# Altium project STM32F407ZGT6_Car.PrjPCB
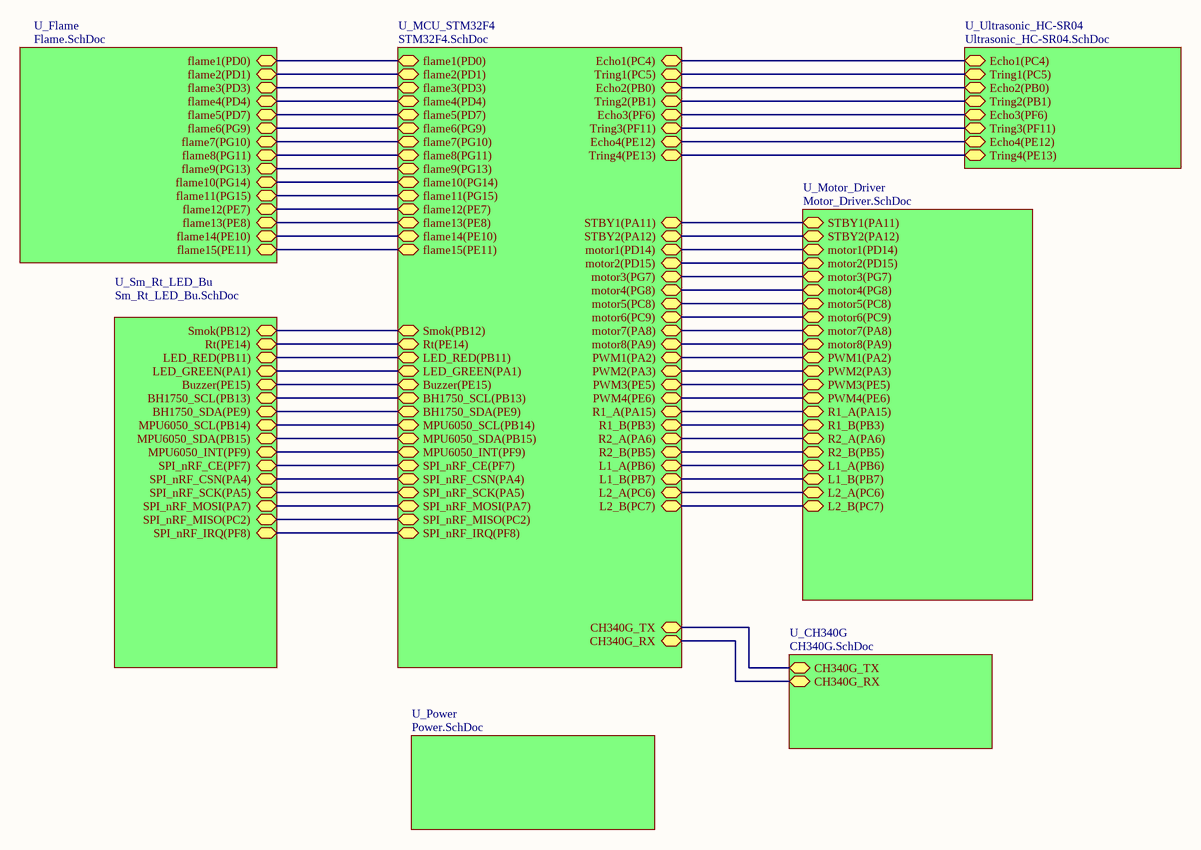
[diagram p0: Frame_Work.SchDoc]
8 sheets, 151 parts. Net scope: hierarchical (ports join the sheet entries above them; power ports are global).
Board file: STM32F4.PcbDoc
Sheets:
  Frame_Work.SchDoc
    U_Flame = Flame.SchDoc
    U_MCU_STM32F4 = STM32F4.SchDoc
    U_Sm_Rt_LED_Bu = Sm_Rt_LED_Bu.SchDoc
    U_Ultrasonic_HC-SR04 = Ultrasonic_HC-SR04.SchDoc
    U_Motor_Driver = Motor_Driver.SchDoc
    U_Power = Power.SchDoc
    U_CH340G = CH340G.SchDoc

## Sheet Frame_Work.SchDoc
size A3

### Sub-sheets
U_CH340G = CH340G.SchDoc: CH340G_TX (bidir), CH340G_RX (bidir)
U_Flame = Flame.SchDoc: flame1(PD0) (bidir), flame2(PD1) (bidir), flame3(PD3) (bidir), flame4(PD4) (bidir), flame5(PD7) (bidir), flame6(PG9) (bidir), flame7(PG10) (bidir), flame8(PG11) (bidir), flame9(PG13) (bidir), flame10(PG14) (bidir), flame11(PG15) (bidir), flame12(PE7) (bidir), flame13(PE8) (bidir), flame14(PE10) (bidir), flame15(PE11) (bidir)
U_MCU_STM32F4 = STM32F4.SchDoc: flame1(PD0) (bidir), flame2(PD1) (bidir), flame3(PD3) (bidir), flame4(PD4) (bidir), flame5(PD7) (bidir), flame6(PG9) (bidir), flame7(PG10) (bidir), flame8(PG11) (bidir), flame9(PG13) (bidir), flame10(PG14) (bidir), flame11(PG15) (bidir), flame12(PE7) (bidir), flame13(PE8) (bidir), flame14(PE10) (bidir), flame15(PE11) (bidir), Smok(PB12) (bidir), Rt(PE14) (bidir), LED_RED(PB11) (bidir), LED_GREEN(PA1) (bidir), Buzzer(PE15) (bidir), Echo1(PC4) (bidir), Tring1(PC5) (bidir), Echo2(PB0) (bidir), Tring2(PB1) (bidir), Echo3(PF6) (bidir), Tring3(PF11) (bidir), Echo4(PE12) (bidir), Tring4(PE13) (bidir), STBY1(PA11) (bidir), STBY2(PA12) (bidir), motor1(PD14) (bidir), motor2(PD15) (bidir), motor3(PG7) (bidir), motor4(PG8) (bidir), motor5(PC8) (bidir), motor6(PC9) (bidir), motor7(PA8) (bidir), motor8(PA9) (bidir), PWM1(PA2) (bidir), PWM2(PA3) (bidir), PWM3(PE5) (bidir), PWM4(PE6) (bidir), R1_A(PA15) (bidir), R1_B(PB3) (bidir), R2_A(PA6) (bidir), R2_B(PB5) (bidir), L1_A(PB6) (bidir), L1_B(PB7) (bidir), L2_A(PC6) (bidir), L2_B(PC7) (bidir), BH1750_SCL(PB13) (bidir), BH1750_SDA(PE9) (bidir), MPU6050_SCL(PB14) (bidir), MPU6050_SDA(PB15) (bidir), MPU6050_INT(PF9) (bidir), SPI_nRF_CE(PF7) (bidir), SPI_nRF_CSN(PA4) (bidir), SPI_nRF_SCK(PA5) (bidir), SPI_nRF_MOSI(PA7) (bidir), SPI_nRF_MISO(PC2) (bidir), SPI_nRF_IRQ(PF8) (bidir), CH340G_TX (bidir), CH340G_RX (bidir)
U_Motor_Driver = Motor_Driver.SchDoc: motor2(PD15) (bidir), motor1(PD14) (bidir), STBY2(PA12) (bidir), STBY1(PA11) (bidir), motor3(PG7) (bidir), motor4(PG8) (bidir), motor5(PC8) (bidir), motor6(PC9) (bidir), motor7(PA8) (bidir), motor8(PA9) (bidir), PWM1(PA2) (bidir), PWM2(PA3) (bidir), PWM3(PE5) (bidir), PWM4(PE6) (bidir), R1_A(PA15) (bidir), R1_B(PB3) (bidir), R2_A(PA6) (bidir), R2_B(PB5) (bidir), L1_A(PB6) (bidir), L1_B(PB7) (bidir), L2_A(PC6) (bidir), L2_B(PC7) (bidir)
U_Power = Power.SchDoc: no entries
U_Sm_Rt_LED_Bu = Sm_Rt_LED_Bu.SchDoc: Smok(PB12) (bidir), Rt(PE14) (bidir), LED_RED(PB11) (bidir), LED_GREEN(PA1) (bidir), Buzzer(PE15) (bidir), BH1750_SCL(PB13) (bidir), BH1750_SDA(PE9) (bidir), MPU6050_SCL(PB14) (bidir), MPU6050_SDA(PB15) (bidir), MPU6050_INT(PF9) (bidir), SPI_nRF_CE(PF7) (bidir), SPI_nRF_CSN(PA4) (bidir), SPI_nRF_SCK(PA5) (bidir), SPI_nRF_MOSI(PA7) (bidir), SPI_nRF_MISO(PC2) (bidir), SPI_nRF_IRQ(PF8) (bidir)
U_Ultrasonic_HC-SR04 = Ultrasonic_HC-SR04.SchDoc: Tring2(PB1) (bidir), Echo2(PB0) (bidir), Tring1(PC5) (bidir), Echo1(PC4) (bidir), Echo3(PF6) (bidir), Tring3(PF11) (bidir), Echo4(PE12) (bidir), Tring4(PE13) (bidir)

### Nets
NetJ1_3: sheet U_Flame/flame5(PD7), sheet U_MCU_STM32F4/flame5(PD7)
NetJ1_4: sheet U_Flame/flame4(PD4), sheet U_MCU_STM32F4/flame4(PD4)
NetJ1_5: sheet U_Flame/flame3(PD3), sheet U_MCU_STM32F4/flame3(PD3)
NetJ1_6: sheet U_Flame/flame2(PD1), sheet U_MCU_STM32F4/flame2(PD1)
NetJ1_7: sheet U_Flame/flame1(PD0), sheet U_MCU_STM32F4/flame1(PD0)
NetJ2_3: sheet U_Flame/flame10(PG14), sheet U_MCU_STM32F4/flame10(PG14)
NetJ2_4: sheet U_Flame/flame9(PG13), sheet U_MCU_STM32F4/flame9(PG13)
NetJ2_5: sheet U_Flame/flame8(PG11), sheet U_MCU_STM32F4/flame8(PG11)
NetJ2_6: sheet U_Flame/flame7(PG10), sheet U_MCU_STM32F4/flame7(PG10)
NetJ2_7: sheet U_Flame/flame6(PG9), sheet U_MCU_STM32F4/flame6(PG9)
NetJ3_3: sheet U_Flame/flame15(PE11), sheet U_MCU_STM32F4/flame15(PE11)
NetJ3_4: sheet U_Flame/flame14(PE10), sheet U_MCU_STM32F4/flame14(PE10)
NetJ3_5: sheet U_Flame/flame13(PE8), sheet U_MCU_STM32F4/flame13(PE8)
NetJ3_6: sheet U_Flame/flame12(PE7), sheet U_MCU_STM32F4/flame12(PE7)
NetJ3_7: sheet U_Flame/flame11(PG15), sheet U_MCU_STM32F4/flame11(PG15)
NetJ4_3: sheet U_MCU_STM32F4/R1_B(PB3), sheet U_Motor_Driver/R1_B(PB3)
NetJ4_4: sheet U_MCU_STM32F4/R1_A(PA15), sheet U_Motor_Driver/R1_A(PA15)
NetJ5_3: sheet U_MCU_STM32F4/R2_B(PB5), sheet U_Motor_Driver/R2_B(PB5)
NetJ5_4: sheet U_MCU_STM32F4/R2_A(PA6), sheet U_Motor_Driver/R2_A(PA6)
NetJ6_3: sheet U_MCU_STM32F4/L2_B(PC7), sheet U_Motor_Driver/L2_B(PC7)
NetJ6_4: sheet U_MCU_STM32F4/L2_A(PC6), sheet U_Motor_Driver/L2_A(PC6)
NetJ7_3: sheet U_MCU_STM32F4/L1_B(PB7), sheet U_Motor_Driver/L1_B(PB7)
NetJ7_4: sheet U_MCU_STM32F4/L1_A(PB6), sheet U_Motor_Driver/L1_A(PB6)
NetJ9_2: sheet U_MCU_STM32F4/Buzzer(PE15), sheet U_Sm_Rt_LED_Bu/Buzzer(PE15)
NetJ10_2: sheet U_MCU_STM32F4/Rt(PE14), sheet U_Sm_Rt_LED_Bu/Rt(PE14)
NetJ11_1: sheet U_MCU_STM32F4/Smok(PB12), sheet U_Sm_Rt_LED_Bu/Smok(PB12)
NetJ12_3: sheet U_MCU_STM32F4/BH1750_SDA(PE9), sheet U_Sm_Rt_LED_Bu/BH1750_SDA(PE9)
NetJ12_4: sheet U_MCU_STM32F4/BH1750_SCL(PB13), sheet U_Sm_Rt_LED_Bu/BH1750_SCL(PB13)
NetJ13_2: sheet U_MCU_STM32F4/Echo1(PC4), sheet U_Ultrasonic_HC-SR04/Echo1(PC4)
NetJ13_3: sheet U_MCU_STM32F4/Tring1(PC5), sheet U_Ultrasonic_HC-SR04/Tring1(PC5)
NetJ14_2: sheet U_MCU_STM32F4/Echo2(PB0), sheet U_Ultrasonic_HC-SR04/Echo2(PB0)
NetJ14_3: sheet U_MCU_STM32F4/Tring2(PB1), sheet U_Ultrasonic_HC-SR04/Tring2(PB1)
NetJ15_2: sheet U_MCU_STM32F4/Echo3(PF6), sheet U_Ultrasonic_HC-SR04/Echo3(PF6)
NetJ15_3: sheet U_MCU_STM32F4/Tring3(PF11), sheet U_Ultrasonic_HC-SR04/Tring3(PF11)
NetJ16_2: sheet U_MCU_STM32F4/Echo4(PE12), sheet U_Ultrasonic_HC-SR04/Echo4(PE12)
NetJ16_3: sheet U_MCU_STM32F4/Tring4(PE13), sheet U_Ultrasonic_HC-SR04/Tring4(PE13)
NetR24_1: sheet U_MCU_STM32F4/LED_RED(PB11), sheet U_Sm_Rt_LED_Bu/LED_RED(PB11)
NetR25_1: sheet U_MCU_STM32F4/LED_GREEN(PA1), sheet U_Sm_Rt_LED_Bu/LED_GREEN(PA1)
NetR31_1: sheet U_MCU_STM32F4/MPU6050_SDA(PB15), sheet U_Sm_Rt_LED_Bu/MPU6050_SDA(PB15)
NetR32_1: sheet U_MCU_STM32F4/MPU6050_SCL(PB14), sheet U_Sm_Rt_LED_Bu/MPU6050_SCL(PB14)
NetU1_15: sheet U_MCU_STM32F4/PWM4(PE6), sheet U_Motor_Driver/PWM4(PE6)
NetU1_16: sheet U_MCU_STM32F4/motor8(PA9), sheet U_Motor_Driver/motor8(PA9)
NetU1_17: sheet U_MCU_STM32F4/motor7(PA8), sheet U_Motor_Driver/motor7(PA8)
NetU1_19: sheet U_MCU_STM32F4/STBY2(PA12), sheet U_Motor_Driver/STBY2(PA12)
NetU1_21: sheet U_MCU_STM32F4/motor6(PC9), sheet U_Motor_Driver/motor6(PC9)
NetU1_22: sheet U_MCU_STM32F4/motor5(PC8), sheet U_Motor_Driver/motor5(PC8)
NetU1_23: sheet U_MCU_STM32F4/PWM3(PE5), sheet U_Motor_Driver/PWM3(PE5)
NetU2_15: sheet U_MCU_STM32F4/PWM2(PA3), sheet U_Motor_Driver/PWM2(PA3)
NetU2_16: sheet U_MCU_STM32F4/motor4(PG8), sheet U_Motor_Driver/motor4(PG8)
NetU2_17: sheet U_MCU_STM32F4/motor3(PG7), sheet U_Motor_Driver/motor3(PG7)
NetU2_19: sheet U_MCU_STM32F4/STBY1(PA11), sheet U_Motor_Driver/STBY1(PA11)
NetU2_21: sheet U_MCU_STM32F4/motor2(PD15), sheet U_Motor_Driver/motor2(PD15)
NetU2_22: sheet U_MCU_STM32F4/motor1(PD14), sheet U_Motor_Driver/motor1(PD14)
NetU2_23: sheet U_MCU_STM32F4/PWM1(PA2), sheet U_Motor_Driver/PWM1(PA2)
NetU8_19: sheet U_MCU_STM32F4/SPI_nRF_CE(PF7), sheet U_Sm_Rt_LED_Bu/SPI_nRF_CE(PF7)
NetU8_20: sheet U_MCU_STM32F4/SPI_nRF_IRQ(PF8), sheet U_Sm_Rt_LED_Bu/SPI_nRF_IRQ(PF8)
NetU8_21: sheet U_MCU_STM32F4/MPU6050_INT(PF9), sheet U_Sm_Rt_LED_Bu/MPU6050_INT(PF9)
NetU8_28: sheet U_MCU_STM32F4/SPI_nRF_MISO(PC2), sheet U_Sm_Rt_LED_Bu/SPI_nRF_MISO(PC2)
NetU8_40: sheet U_MCU_STM32F4/SPI_nRF_CSN(PA4), sheet U_Sm_Rt_LED_Bu/SPI_nRF_CSN(PA4)
NetU8_41: sheet U_MCU_STM32F4/SPI_nRF_SCK(PA5), sheet U_Sm_Rt_LED_Bu/SPI_nRF_SCK(PA5)
NetU8_43: sheet U_MCU_STM32F4/SPI_nRF_MOSI(PA7), sheet U_Sm_Rt_LED_Bu/SPI_nRF_MOSI(PA7)
NetU8_90: sheet U_MCU_STM32F4/CH340G_TX, sheet U_CH340G/CH340G_TX
NetU8_91: sheet U_MCU_STM32F4/CH340G_RX, sheet U_CH340G/CH340G_RX

## Sheet Flame.SchDoc
size A4
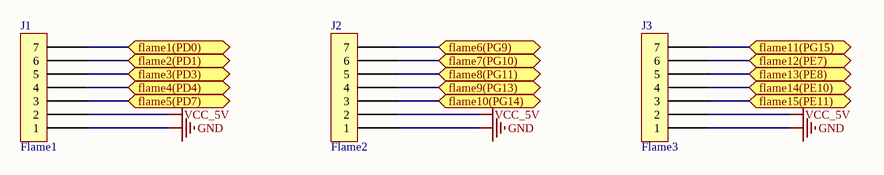
[diagram p1: Flame.SchDoc]

### Parts
J1  Flame1  [XH2.54-LI-7P]
J2  Flame2  [XH2.54-LI-7P]
J3  Flame3  [XH2.54-LI-7P]

### Ports
flame1(PD0) (bidir), flame2(PD1) (bidir), flame3(PD3) (bidir), flame4(PD4) (bidir), flame5(PD7) (bidir), flame6(PG9) (bidir), flame7(PG10) (bidir), flame8(PG11) (bidir), flame9(PG13) (bidir), flame10(PG14) (bidir), flame11(PG15) (bidir), flame12(PE7) (bidir), flame13(PE8) (bidir), flame14(PE10) (bidir), flame15(PE11) (bidir)

### Nets
GND: J1.1 J2.1 J3.1
VCC_5V: J1.2 J2.2 J3.2
NetJ1_3: J1.3 ; port flame5(PD7)
NetJ1_4: J1.4 ; port flame4(PD4)
NetJ1_5: J1.5 ; port flame3(PD3)
NetJ1_6: J1.6 ; port flame2(PD1)
NetJ1_7: J1.7 ; port flame1(PD0)
NetJ2_3: J2.3 ; port flame10(PG14)
NetJ2_4: J2.4 ; port flame9(PG13)
NetJ2_5: J2.5 ; port flame8(PG11)
NetJ2_6: J2.6 ; port flame7(PG10)
NetJ2_7: J2.7 ; port flame6(PG9)
NetJ3_3: J3.3 ; port flame15(PE11)
NetJ3_4: J3.4 ; port flame14(PE10)
NetJ3_5: J3.5 ; port flame13(PE8)
NetJ3_6: J3.6 ; port flame12(PE7)
NetJ3_7: J3.7 ; port flame11(PG15)

### Library data of the parts
J1-J3 = Component_1

## Sheet STM32F4.SchDoc
size A3
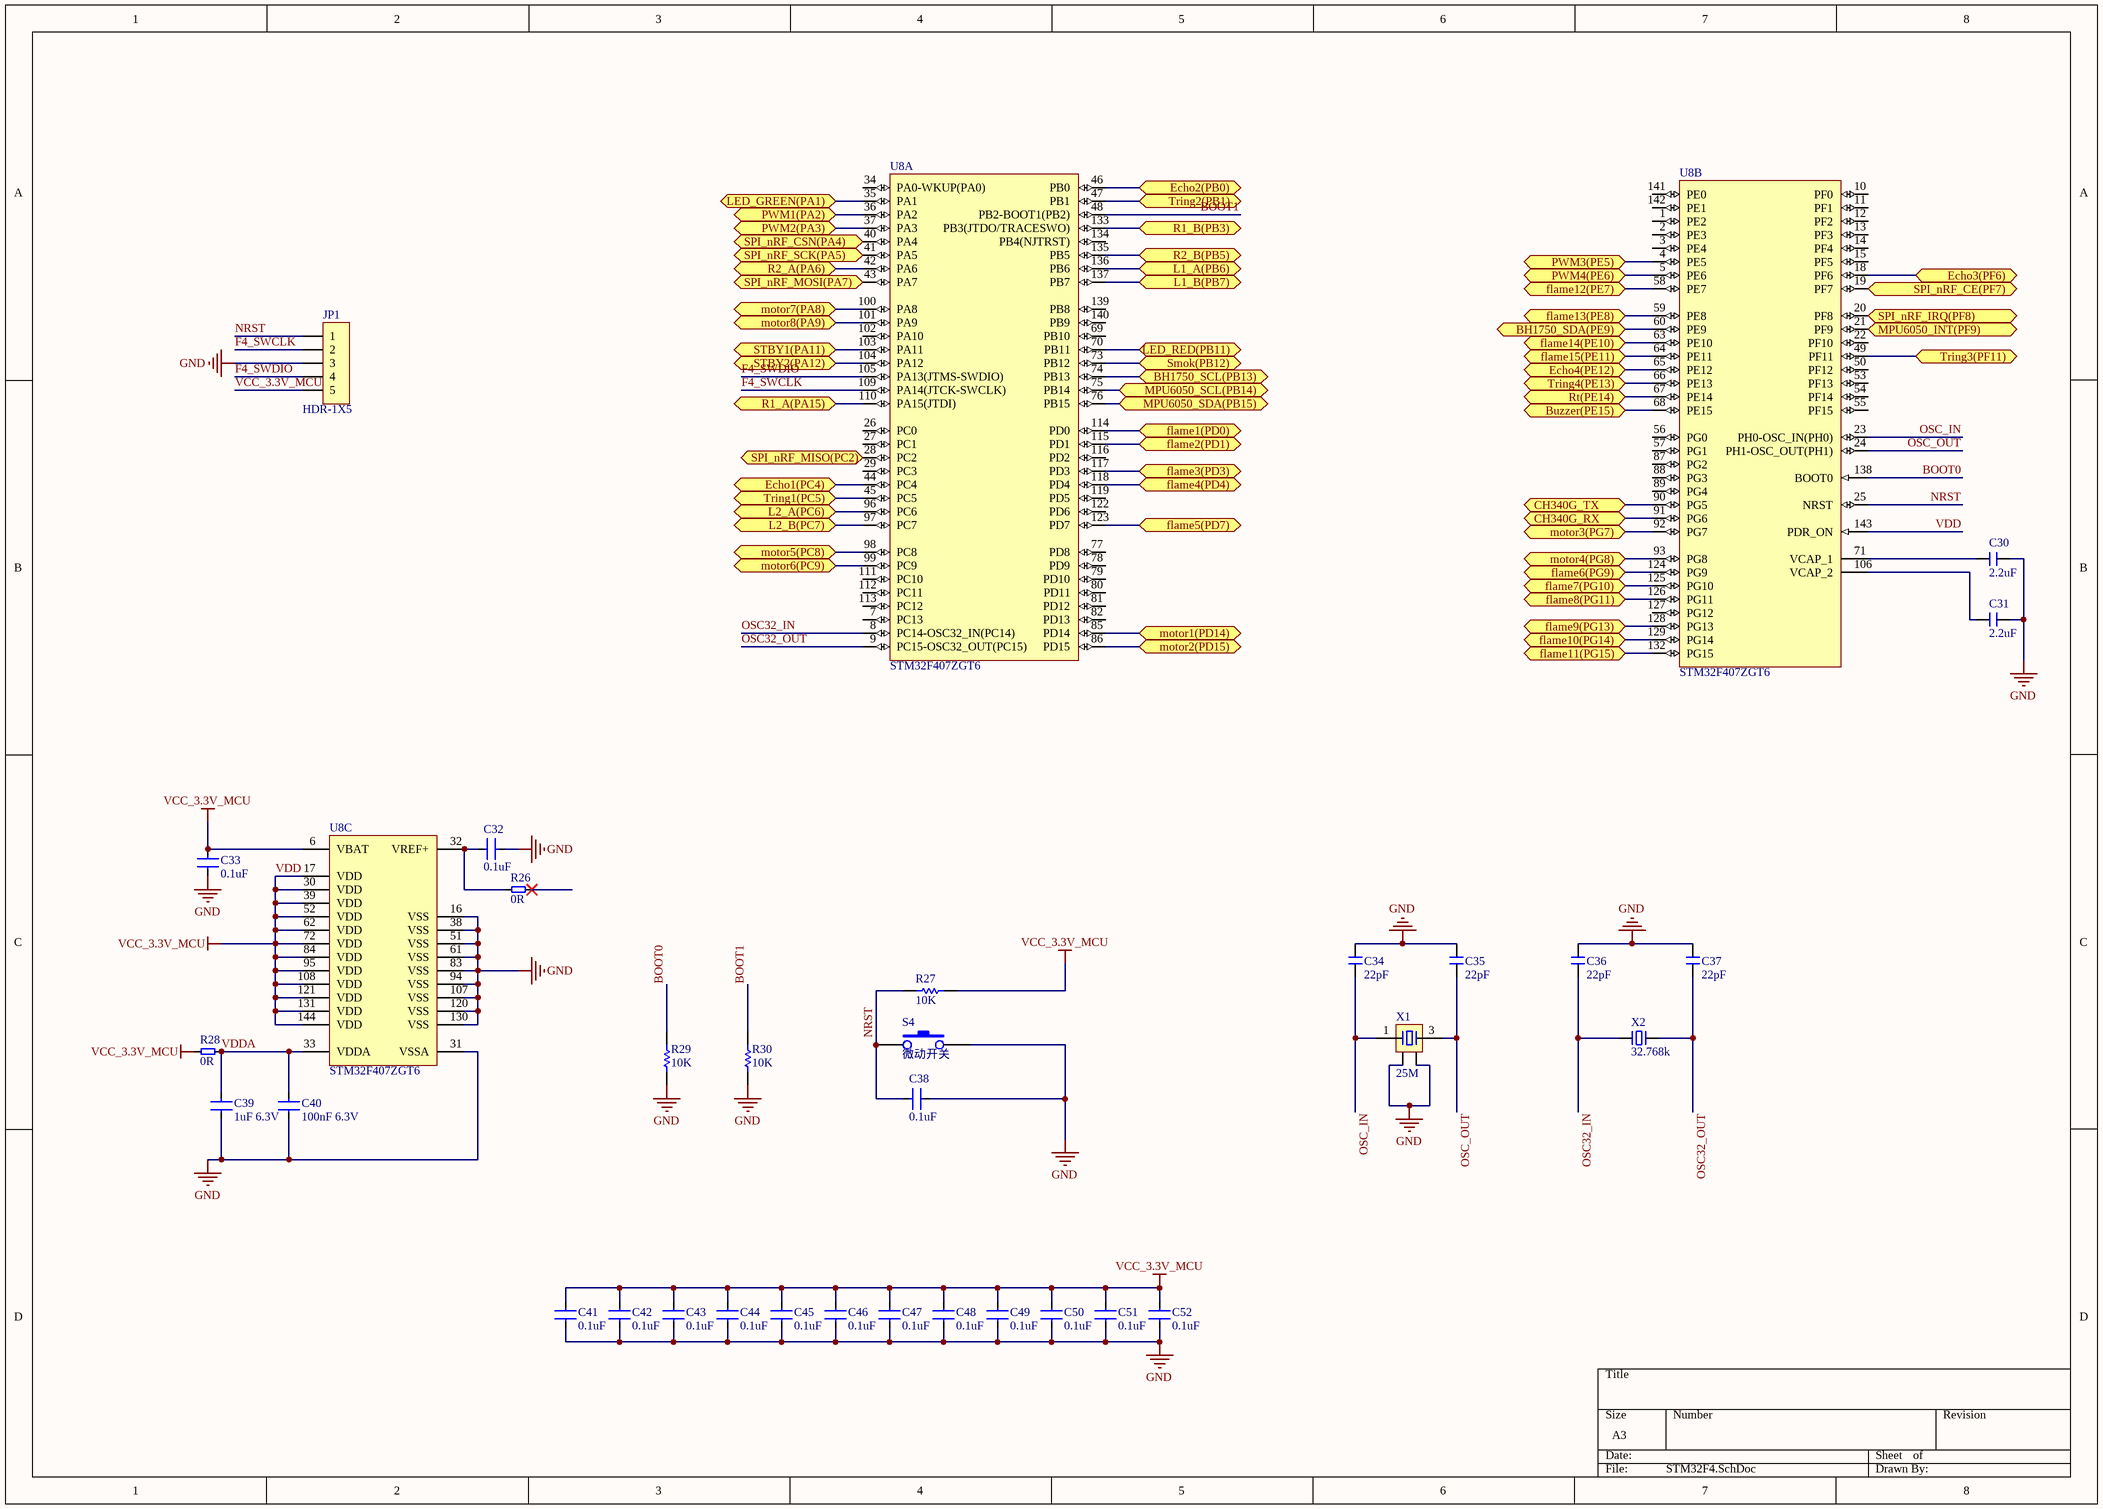
[diagram p2: STM32F4.SchDoc]

### Parts
C30  2.2uF  [0603_C]
C31  2.2uF  [0603_C]
C32  0.1uF  [0603_C]
C33  0.1uF  [0603_C]
C34  22pF  [0603_C]
C35  22pF  [0603_C]
C36  22pF  [0603_C]
C37  22pF  [0603_C]
C38  0.1uF  [0603_C]
C39  1uF 6.3V  [0603_C]
C40  100nF 6.3V  [0603_C]
C41  0.1uF  [0603_C]
C42  0.1uF  [0603_C]
C43  0.1uF  [0603_C]
C44  0.1uF  [0603_C]
C45  0.1uF  [0603_C]
C46  0.1uF  [0603_C]
C47  0.1uF  [0603_C]
C48  0.1uF  [0603_C]
C49  0.1uF  [0603_C]
C50  0.1uF  [0603_C]
C51  0.1uF  [0603_C]
C52  0.1uF  [0603_C]
JP1  HDR-1X5  [XH2.54-WI-5P]
R26  0R  [0603_L]
R27  10K  [0603_R]
R28  0R  [0603_L]
R29  10K  [0603_R]
R30  10K  [0603_R]
S4  微动开关  [微动开关-1]
U8  STM32F407ZGT6  [STM-LQFP144_N]  (parts A,B,C of 3)
X1  25M  [SMD-3225_4P]
X2  32.768k  [SMD-3215_2P FC - 135]

### Ports
BH1750_SCL(PB13) (bidir), BH1750_SDA(PE9) (bidir), Buzzer(PE15) (bidir), CH340G_RX (bidir), CH340G_TX (bidir), Echo1(PC4) (bidir), Echo2(PB0) (bidir), Echo3(PF6) (bidir), Echo4(PE12) (bidir), flame1(PD0) (bidir), flame2(PD1) (bidir), flame3(PD3) (bidir), flame4(PD4) (bidir), flame5(PD7) (bidir), flame6(PG9) (bidir), flame7(PG10) (bidir), flame8(PG11) (bidir), flame9(PG13) (bidir), flame10(PG14) (bidir), flame11(PG15) (bidir), flame12(PE7) (bidir), flame13(PE8) (bidir), flame14(PE10) (bidir), flame15(PE11) (bidir), L1_A(PB6) (bidir), L1_B(PB7) (bidir), L2_A(PC6) (bidir), L2_B(PC7) (bidir), LED_GREEN(PA1) (bidir), LED_RED(PB11) (bidir), motor1(PD14) (bidir), motor2(PD15) (bidir), motor3(PG7) (bidir), motor4(PG8) (bidir), motor5(PC8) (bidir), motor6(PC9) (bidir), motor7(PA8) (bidir), motor8(PA9) (bidir), MPU6050_INT(PF9) (bidir), MPU6050_SCL(PB14) (bidir), MPU6050_SDA(PB15) (bidir), PWM1(PA2) (bidir), PWM2(PA3) (bidir), PWM3(PE5) (bidir), PWM4(PE6) (bidir), R1_A(PA15) (bidir), R1_B(PB3) (bidir), R2_A(PA6) (bidir), R2_B(PB5) (bidir), Rt(PE14) (bidir), Smok(PB12) (bidir), SPI_nRF_CE(PF7) (bidir), SPI_nRF_CSN(PA4) (bidir), SPI_nRF_IRQ(PF8) (bidir), SPI_nRF_MISO(PC2) (bidir), SPI_nRF_MOSI(PA7) (bidir), SPI_nRF_SCK(PA5) (bidir), STBY1(PA11) (bidir), STBY2(PA12) (bidir), Tring1(PC5) (bidir), Tring2(PB1) (bidir), Tring3(PF11) (bidir), Tring4(PE13) (bidir)

### Nets
GND: C30.2 C31.1 C32.2 C33.1 C34.1 C35.1 C36.1 C37.1 C38.2 C39.2 C40.2 C41.1 C42.1 C43.1 C44.1 C45.1 C46.1 C47.1 C48.1 C49.1 C50.1 C51.1 C52.1 JP1.3 R29.2 R30.2 S4.2 U8.16(VSS) U8.31(VSSA) U8.38(VSS) U8.51(VSS) U8.61(VSS) U8.83(VSS) U8.94(VSS) U8.107(VSS) U8.120(VSS) U8.130(VSS) X1.2 X1.4
VCC_3.3V_MCU: C33.2 C41.2 C42.2 C43.2 C44.2 C45.2 C46.2 C47.2 C48.2 C49.2 C50.2 C51.2 C52.2 JP1.5 R27.2 R28.1 U8.6(VBAT) U8.17(VDD) U8.30(VDD) U8.39(VDD) U8.52(VDD) U8.62(VDD) U8.72(VDD) U8.84(VDD) U8.95(VDD) U8.108(VDD) U8.121(VDD) U8.131(VDD) U8.143(PDR_ON) U8.144(VDD)  [also labelled VDD]
BOOT0: R29.1 U8.138(BOOT0)
BOOT1: R30.1 U8.48(PB2-BOOT1(PB2))
F4_SWCLK: JP1.2 U8.109(PA14(JTCK-SWCLK))
F4_SWDIO: JP1.4 U8.105(PA13(JTMS-SWDIO))
NRST: C38.1 JP1.1 R27.1 S4.1 U8.25(NRST)
OSC32_IN: C36.2 U8.8(PC14-OSC32_IN(PC14)) X2.1
OSC32_OUT: C37.2 U8.9(PC15-OSC32_OUT(PC15)) X2.2
OSC_IN: C34.2 U8.23(PH0-OSC_IN(PH0)) X1.1
OSC_OUT: C35.2 U8.24(PH1-OSC_OUT(PH1)) X1.3
VDDA: C39.1 C40.1 R28.2 U8.33(VDDA)
NetC30_1: C30.1 U8.71(VCAP_1)
NetC31_2: C31.2 U8.106(VCAP_2)
NetC32_1: C32.1 R26.1 U8.32(VREF+)
NetJ1_3: U8.123(PD7) ; port flame5(PD7)
NetJ1_4: U8.118(PD4) ; port flame4(PD4)
NetJ1_5: U8.117(PD3) ; port flame3(PD3)
NetJ1_6: U8.115(PD1) ; port flame2(PD1)
NetJ1_7: U8.114(PD0) ; port flame1(PD0)
NetJ2_3: U8.129(PG14) ; port flame10(PG14)
NetJ2_4: U8.128(PG13) ; port flame9(PG13)
NetJ2_5: U8.126(PG11) ; port flame8(PG11)
NetJ2_6: U8.125(PG10) ; port flame7(PG10)
NetJ2_7: U8.124(PG9) ; port flame6(PG9)
NetJ3_3: U8.64(PE11) ; port flame15(PE11)
NetJ3_4: U8.63(PE10) ; port flame14(PE10)
NetJ3_5: U8.59(PE8) ; port flame13(PE8)
NetJ3_6: U8.58(PE7) ; port flame12(PE7)
NetJ3_7: U8.132(PG15) ; port flame11(PG15)
NetJ4_3: U8.133(PB3(JTDO/TRACESWO)) ; port R1_B(PB3)
NetJ4_4: U8.110(PA15(JTDI)) ; port R1_A(PA15)
NetJ5_3: U8.135(PB5) ; port R2_B(PB5)
NetJ5_4: U8.42(PA6) ; port R2_A(PA6)
NetJ6_3: U8.97(PC7) ; port L2_B(PC7)
NetJ6_4: U8.96(PC6) ; port L2_A(PC6)
NetJ7_3: U8.137(PB7) ; port L1_B(PB7)
NetJ7_4: U8.136(PB6) ; port L1_A(PB6)
NetJ9_2: U8.68(PE15) ; port Buzzer(PE15)
NetJ10_2: U8.67(PE14) ; port Rt(PE14)
NetJ11_1: U8.73(PB12) ; port Smok(PB12)
NetJ12_3: U8.60(PE9) ; port BH1750_SDA(PE9)
NetJ12_4: U8.74(PB13) ; port BH1750_SCL(PB13)
NetJ13_2: U8.44(PC4) ; port Echo1(PC4)
NetJ13_3: U8.45(PC5) ; port Tring1(PC5)
NetJ14_2: U8.46(PB0) ; port Echo2(PB0)
NetJ14_3: U8.47(PB1) ; port Tring2(PB1)
NetJ15_2: U8.18(PF6) ; port Echo3(PF6)
NetJ15_3: U8.49(PF11) ; port Tring3(PF11)
NetJ16_2: U8.65(PE12) ; port Echo4(PE12)
NetJ16_3: U8.66(PE13) ; port Tring4(PE13)
NetR24_1: U8.70(PB11) ; port LED_RED(PB11)
NetR25_1: U8.35(PA1) ; port LED_GREEN(PA1)
NetR31_1: U8.76(PB15) ; port MPU6050_SDA(PB15)
NetR32_1: U8.75(PB14) ; port MPU6050_SCL(PB14)
NetU1_15: U8.5(PE6) ; port PWM4(PE6)
NetU1_16: U8.101(PA9) ; port motor8(PA9)
NetU1_17: U8.100(PA8) ; port motor7(PA8)
NetU1_19: U8.104(PA12) ; port STBY2(PA12)
NetU1_21: U8.99(PC9) ; port motor6(PC9)
NetU1_22: U8.98(PC8) ; port motor5(PC8)
NetU1_23: U8.4(PE5) ; port PWM3(PE5)
NetU2_15: U8.37(PA3) ; port PWM2(PA3)
NetU2_16: U8.93(PG8) ; port motor4(PG8)
NetU2_17: U8.92(PG7) ; port motor3(PG7)
NetU2_19: U8.103(PA11) ; port STBY1(PA11)
NetU2_21: U8.86(PD15) ; port motor2(PD15)
NetU2_22: U8.85(PD14) ; port motor1(PD14)
NetU2_23: U8.36(PA2) ; port PWM1(PA2)
NetU8_19: U8.19(PF7) ; port SPI_nRF_CE(PF7)
NetU8_20: U8.20(PF8) ; port SPI_nRF_IRQ(PF8)
NetU8_21: U8.21(PF9) ; port MPU6050_INT(PF9)
NetU8_28: U8.28(PC2) ; port SPI_nRF_MISO(PC2)
NetU8_40: U8.40(PA4) ; port SPI_nRF_CSN(PA4)
NetU8_41: U8.41(PA5) ; port SPI_nRF_SCK(PA5)
NetU8_43: U8.43(PA7) ; port SPI_nRF_MOSI(PA7)
NetU8_90: U8.90(PG5) ; port CH340G_TX
NetU8_91: U8.91(PG6) ; port CH340G_RX

Not connected (* = marked no-connect by the designer): R26 2*; U8 1(PE2) 2(PE3) 3(PE4) 7(PC13) 10(PF0) 11(PF1) 12(PF2) 13(PF3) 14(PF4) 15(PF5) 22(PF10) 26(PC0) 27(PC1) 29(PC3) 34(PA0-WKUP(PA0)) 50(PF12) 53(PF13) 54(PF14) 55(PF15) 56(PG0) 57(PG1) 69(PB10) 77(PD8) 78(PD9) 79(PD10) 80(PD11) 81(PD12) 82(PD13) 87(PG2) 88(PG3) 89(PG4) 102(PA10) 111(PC10) 112(PC11) 113(PC12) 116(PD2) 119(PD5) 122(PD6) 127(PG12) 134(PB4(NJTRST)) 139(PB8) 140(PB9) 141(PE0) 142(PE1)

### Library data of the parts
C30 C31 C34-C37 = C: 无极性贴片电容
C32 C33 C38-C52 = C0805
JP1 = Header 5: 5P接插件
R26 R28 = R0805
R27 R29 R30 = Res1: Resistor
U8 = STM32F407ZGT6: ARM Cortex-M4 32-bit MCU+FPU, 210 DMIPS, 1024 kB Flash, 192 kB Internal RAM, 114 I/Os, 144-pin LQFP, -40 to 85 degC, Tray; Manufacturer: STMicroelectronics; D/A Converter: 2x12-bit; FLASH Size (Prog) (kB): 1024; I/Os (High Current): 114; Internal RAM Size (kB): 192; Operating Frequency(F) (Processor speed) (MHz): 168; Supply Voltage(Vcc) max (V): 3.6; Supply Voltage(Vcc) min (V): 1.8; DatasheetVersion: Rev. 4; PackageVersion: Rev. 4, 06/2013; PackageReference: LQFP144; PackageDescription: 144-Pin Low Profile Quad Flat Package, 20 x 20 mm Body, 0.5 mm Pitch; Supplier 1: Digi-Key; Supplier Part Number 1: 497-11766-ND; Supplier 2: Newark; Supplier Part Number 2: 73T2334; Supplier 3: Mouser; Supplier Part Number 3: 511-STM32F407ZGT6; Core: ARM Cortex-M4; Packing: Tray; Mounting Technology: Surface Mount; PartNumber: STM32F407ZGT6; ComponentLink3Description: Package Specification; ComponentLink3URL: http://www.st.com/st-web-ui/static/active/en/resource/technical/document/datasheet/DM00037051.pdf
X1 = XTAL-4P: 4脚无源晶振
X2 = XTAL-2P: 2脚无源脚晶振

## Sheet Sm_Rt_LED_Bu.SchDoc
size A4
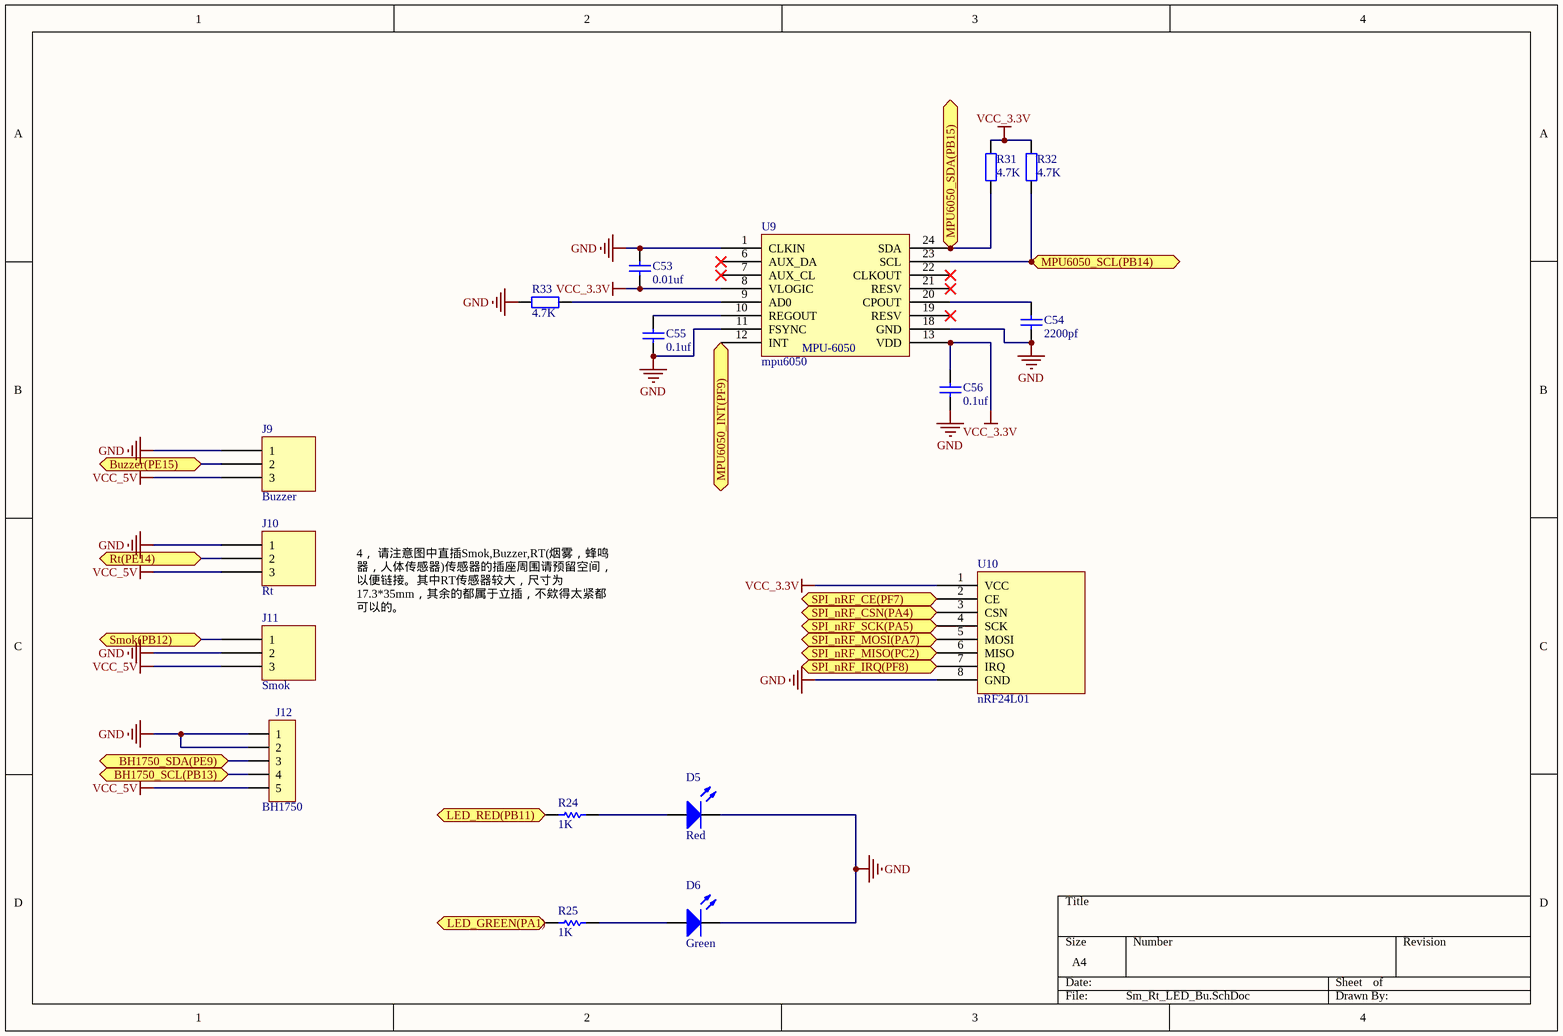
[diagram p3: Sm_Rt_LED_Bu.SchDoc]

### Parts
C53  0.01uf  [0603_C]
C54  2200pf  [0603_C]
C55  0.1uf  [0603_C]
C56  0.1uf  [0603_C]
D5  Red  [0805_LED_S1]
D6  Green  [0805_LED_S1]
J9  Buzzer  [HDR1X3]
J10  Rt  [HDR1X3]
J11  Smok  [HDR1X3]
J12  BH1750  [XH2.54-LI-5P]
R24  1K  [0603_R]
R25  1K  [0603_R]
R31  4.7K  [0603_R]
R32  4.7K  [0603_R]
R33  4.7K  [0603_R]
U9  mpu6050  [QFN-24_4x4x05P]
U10  nRF24L01  [AS01-spipx]

### Ports
BH1750_SCL(PB13) (bidir), BH1750_SDA(PE9) (bidir), Buzzer(PE15) (bidir), LED_GREEN(PA1) (bidir), LED_RED(PB11) (bidir), MPU6050_INT(PF9) (bidir), MPU6050_SCL(PB14) (bidir), MPU6050_SDA(PB15) (bidir), Rt(PE14) (bidir), Smok(PB12) (bidir), SPI_nRF_CE(PF7) (bidir), SPI_nRF_CSN(PA4) (bidir), SPI_nRF_IRQ(PF8) (bidir), SPI_nRF_MISO(PC2) (bidir), SPI_nRF_MOSI(PA7) (bidir), SPI_nRF_SCK(PA5) (bidir)

### Nets
GND: C53.2 C54.1 C55.1 C56.1 D5.K D6.K J9.1 J10.1 J11.2 J12.1 J12.2 R33.2 U9.1(CLKIN) U9.11(FSYNC) U9.18(GND) U10.8(GND)
VCC_3.3V: C53.1 C56.2 R31.2 R32.2 U9.8(VLOGIC) U9.13(VDD) U10.1(VCC)
VCC_5V: J9.3 J10.3 J11.3 J12.5
NetC54_2: C54.2 U9.20(CPOUT)
NetC55_2: C55.2 U9.10(REGOUT)
NetD5_A: D5.A R24.2
NetD6_A: D6.A R25.2
NetJ9_2: J9.2 ; port Buzzer(PE15)
NetJ10_2: J10.2 ; port Rt(PE14)
NetJ11_1: J11.1 ; port Smok(PB12)
NetJ12_3: J12.3 ; port BH1750_SDA(PE9)
NetJ12_4: J12.4 ; port BH1750_SCL(PB13)
NetR24_1: R24.1 ; port LED_RED(PB11)
NetR25_1: R25.1 ; port LED_GREEN(PA1)
NetR31_1: R31.1 U9.24(SDA) ; port MPU6050_SDA(PB15)
NetR32_1: R32.1 U9.23(SCL) ; port MPU6050_SCL(PB14)
NetR33_1: R33.1 U9.9(AD0)
NetU8_19: U10.2(CE) ; port SPI_nRF_CE(PF7)
NetU8_20: U10.7(IRQ) ; port SPI_nRF_IRQ(PF8)
NetU8_21: U9.12(INT) ; port MPU6050_INT(PF9)
NetU8_28: U10.6(MISO) ; port SPI_nRF_MISO(PC2)
NetU8_40: U10.3(CSN) ; port SPI_nRF_CSN(PA4)
NetU8_41: U10.4(SCK) ; port SPI_nRF_SCK(PA5)
NetU8_43: U10.5(MOSI) ; port SPI_nRF_MOSI(PA7)

Not connected (* = marked no-connect by the designer): U9 6(AUX_DA)* 7(AUX_CL)* 19(RESV)* 21(RESV)* 22(CLKOUT)*

### Notes on the sheet
- 4，	请注意图中直插Smok,Buzzer,RT(烟雾，蜂鸣器，人体传感器)传感器的插座周围请预留空间，以便链接。其中RT传感器较大，尺寸为17.3*35mm，其余的都属于立插，不欸得太紧都可以的。
- (in symbol mpu6050) MPU-6050

### Library data of the parts
C53-C56 = CAP-0603: 贴片电容
D5 = LED_Red: 直插
D6 = LED_Green: 直插
J9-J11 = Component_2
J12 = Header 5: 5P接插件
R24 R25 = Res1: Resistor
R31-R33 = Res-0603: 贴片电阻
U10 = Component_9

## Sheet Ultrasonic_HC-SR04.SchDoc
size A4
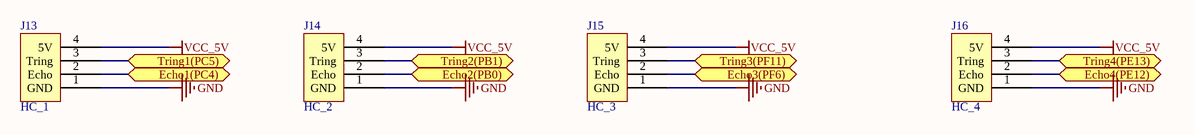
[diagram p4: Ultrasonic_HC-SR04.SchDoc]

### Parts
J13  HC_1  [XH2.54-WI-4P]
J14  HC_2  [XH2.54-WI-4P]
J15  HC_3  [XH2.54-WI-4P]
J16  HC_4  [XH2.54-WI-4P]

### Ports
Echo1(PC4) (bidir), Echo2(PB0) (bidir), Echo3(PF6) (bidir), Echo4(PE12) (bidir), Tring1(PC5) (bidir), Tring2(PB1) (bidir), Tring3(PF11) (bidir), Tring4(PE13) (bidir)

### Nets
GND: J13.1(GND) J14.1(GND) J15.1(GND) J16.1(GND)
VCC_5V: J13.4(5V) J14.4(5V) J15.4(5V) J16.4(5V)
NetJ13_2: J13.2(Echo) ; port Echo1(PC4)
NetJ13_3: J13.3(Tring) ; port Tring1(PC5)
NetJ14_2: J14.2(Echo) ; port Echo2(PB0)
NetJ14_3: J14.3(Tring) ; port Tring2(PB1)
NetJ15_2: J15.2(Echo) ; port Echo3(PF6)
NetJ15_3: J15.3(Tring) ; port Tring3(PF11)
NetJ16_2: J16.2(Echo) ; port Echo4(PE12)
NetJ16_3: J16.3(Tring) ; port Tring4(PE13)

### Library data of the parts
J13-J16 = Component_5

## Sheet Motor_Driver.SchDoc
size A4
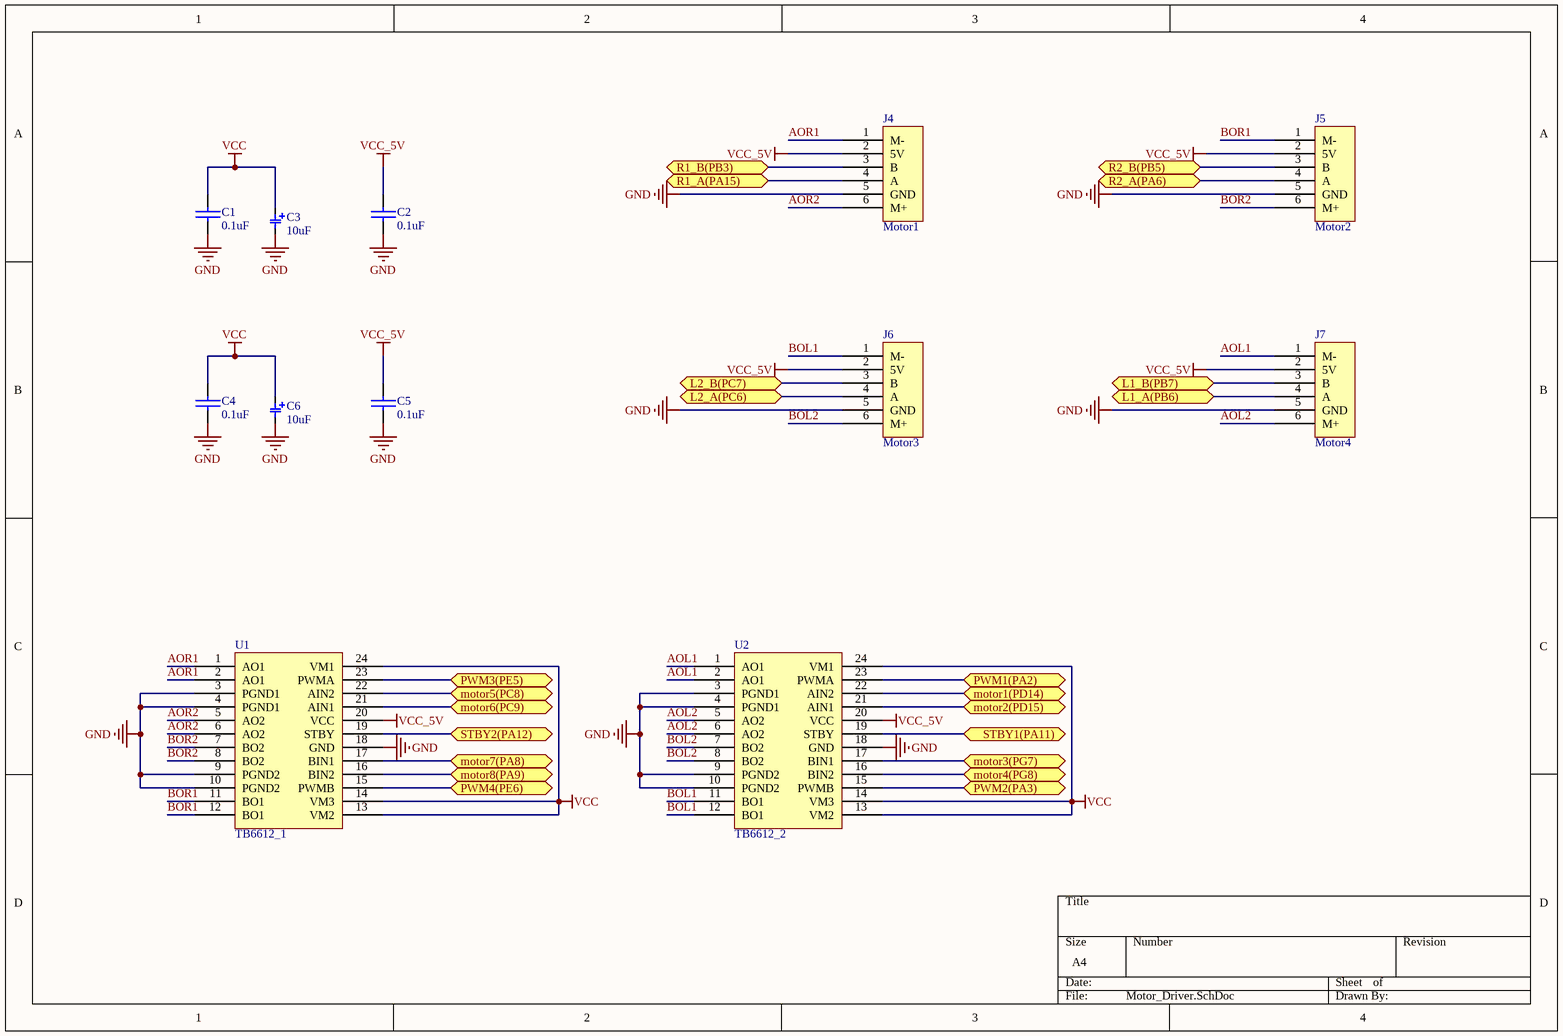
[diagram p5: Motor_Driver.SchDoc]

### Parts
C1  0.1uF  [0603_C]
C2  0.1uF  [0603_C]
C3  10uF  [CASE-B_3528]
C4  0.1uF  [0603_C]
C5  0.1uF  [0603_C]
C6  10uF  [CASE-B_3528]
J4  Motor1  [XH2.54-WI-6P]
J5  Motor2  [XH2.54-WI-6P]
J6  Motor3  [XH2.54-WI-6P]
J7  Motor4  [XH2.54-WI-6P]
U1  TB6612_1  [SSOP-24_208mil]
U2  TB6612_2  [SSOP-24_208mil]

### Ports
L1_A(PB6) (bidir), L1_B(PB7) (bidir), L2_A(PC6) (bidir), L2_B(PC7) (bidir), motor1(PD14) (bidir), motor2(PD15) (bidir), motor3(PG7) (bidir), motor4(PG8) (bidir), motor5(PC8) (bidir), motor6(PC9) (bidir), motor7(PA8) (bidir), motor8(PA9) (bidir), PWM1(PA2) (bidir), PWM2(PA3) (bidir), PWM3(PE5) (bidir), PWM4(PE6) (bidir), R1_A(PA15) (bidir), R1_B(PB3) (bidir), R2_A(PA6) (bidir), R2_B(PB5) (bidir), STBY1(PA11) (bidir), STBY2(PA12) (bidir)

### Nets
GND: C1.2 C2.2 C3.2 C4.2 C5.2 C6.2 J4.5(GND) J5.5(GND) J6.5(GND) J7.5(GND) U1.3(PGND1) U1.4(PGND1) U1.9(PGND2) U1.10(PGND2) U1.18(GND) U2.3(PGND1) U2.4(PGND1) U2.9(PGND2) U2.10(PGND2) U2.18(GND)
VCC: C1.1 C3.1 C4.1 C6.1 U1.13(VM2) U1.14(VM3) U1.24(VM1) U2.13(VM2) U2.14(VM3) U2.24(VM1)
VCC_5V: C2.1 C5.1 J4.2(5V) J5.2(5V) J6.2(5V) J7.2(5V) U1.20(VCC) U2.20(VCC)
AOL1: J7.1(M-) U2.1(AO1) U2.2(AO1)
AOL2: J7.6(M+) U2.5(AO2) U2.6(AO2)
AOR1: J4.1(M-) U1.1(AO1) U1.2(AO1)
AOR2: J4.6(M+) U1.5(AO2) U1.6(AO2)
BOL1: J6.1(M-) U2.11(BO1) U2.12(BO1)
BOL2: J6.6(M+) U2.7(BO2) U2.8(BO2)
BOR1: J5.1(M-) U1.11(BO1) U1.12(BO1)
BOR2: J5.6(M+) U1.7(BO2) U1.8(BO2)
NetJ4_3: J4.3(B) ; port R1_B(PB3)
NetJ4_4: J4.4(A) ; port R1_A(PA15)
NetJ5_3: J5.3(B) ; port R2_B(PB5)
NetJ5_4: J5.4(A) ; port R2_A(PA6)
NetJ6_3: J6.3(B) ; port L2_B(PC7)
NetJ6_4: J6.4(A) ; port L2_A(PC6)
NetJ7_3: J7.3(B) ; port L1_B(PB7)
NetJ7_4: J7.4(A) ; port L1_A(PB6)
NetU1_15: U1.15(PWMB) ; port PWM4(PE6)
NetU1_16: U1.16(BIN2) ; port motor8(PA9)
NetU1_17: U1.17(BIN1) ; port motor7(PA8)
NetU1_19: U1.19(STBY) ; port STBY2(PA12)
NetU1_21: U1.21(AIN1) ; port motor6(PC9)
NetU1_22: U1.22(AIN2) ; port motor5(PC8)
NetU1_23: U1.23(PWMA) ; port PWM3(PE5)
NetU2_15: U2.15(PWMB) ; port PWM2(PA3)
NetU2_16: U2.16(BIN2) ; port motor4(PG8)
NetU2_17: U2.17(BIN1) ; port motor3(PG7)
NetU2_19: U2.19(STBY) ; port STBY1(PA11)
NetU2_21: U2.21(AIN1) ; port motor2(PD15)
NetU2_22: U2.22(AIN2) ; port motor1(PD14)
NetU2_23: U2.23(PWMA) ; port PWM1(PA2)

### Library data of the parts
C1 C2 C4 C5 = 普通电容: Capacitor
C3 C6 = ECAP
J4-J7 = Component_4
U1 U2 = Component_3

## Sheet Power.SchDoc
size B
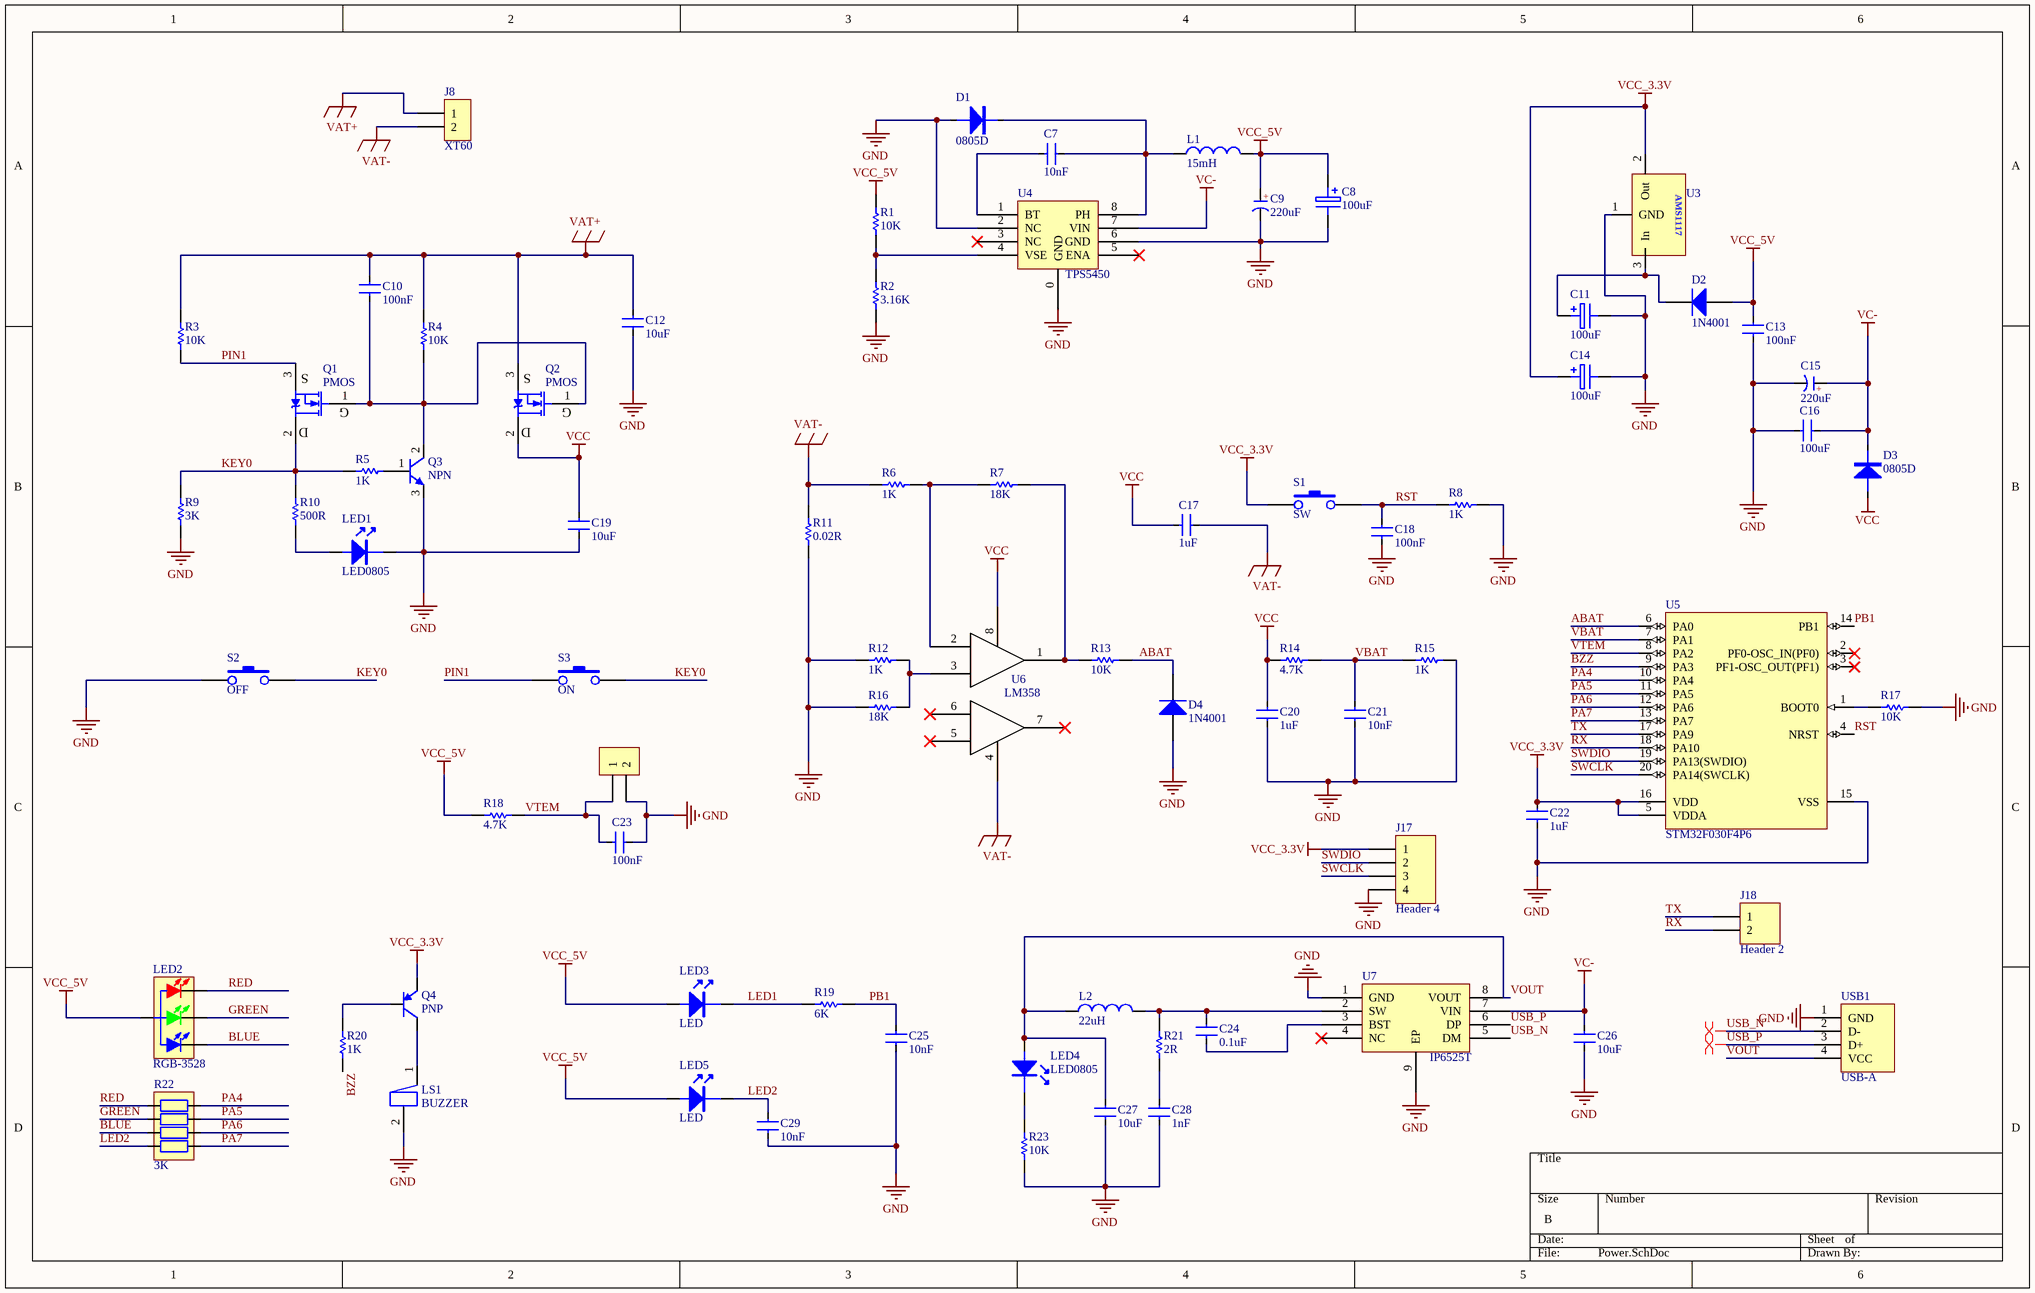
[diagram p6: Power.SchDoc]

### Parts
C7  10nF  [0603_C]
C8  100uF  [CASE-C_6032]
C9  220uF  [CASE-E_7343]
C10  100nF  [0603_C]
C11  100uF  [CASE-C_6032]
C12  10uF  [1206_C]
C13  100nF  [0603_C]
C14  100uF  [CASE-B_3528]
C15  220uF  [CASE-E_7343]
C16  100uF  [1206_C]
C17  1uF  [0603_C]
C18  100nF  [0603_C]
C19  10uF  [1206_C]
C20  1uF  [0603_C]
C21  10nF  [0603_C]
C22  1uF  [0603_C]
C23  100nF  [0603_C]
C24  0.1uF  [0603_C]
C25  10nF  [0603_C]
C26  10uF  [1206_C]
C27  10uF  [0603_C]
C28  1nF  [0603_C]
C29  10nF  [0603_C]
D1  0805D  [SMB N]
D2  Type: 1N4001  [DIODE-1206]  (hidden comment: Diode)
D3  0805D  [SMB N]
D4  Type: 1N4001  [DIODE-1206]  (hidden comment: Diode)
J8  XT60  [TX60-LI-S]
J17  Header 4  [XH2.54-WI-4P]
J18  Header 2  [XH2.54-LI-2P]
J？1  XT60  [LC-0805_R]  (value not drawn)
L1  15mH  [IND-SMD_L6.0-W6.0_FNR60XXS]
L2  22uH  [IND-SMD_L6.0-W6.0_FNR60XXS]
LED1  LED0805  [LC-0603_LED_S1]
LED2  RGB-3528  [RGB-3528]
LED3  LED  [LC-0603_LED_S1]
LED4  LED0805  [LC-0603_LED_S1]
LED5  LED  [LC-0603_LED_S1]
LS1  BUZZER  [Beep]
Q1  PMOS  [TO-252-2-180]
Q2  PMOS  [TO-252-2-180]
Q3  NPN  [SOT-23(SOT-23-3)]
Q4  PNP  [SOT-23(SOT-23-3)]
R1  10K  [0603_R]
R2  3.16K  [0603_R]
R3  10K  [0603_R]
R4  10K  [0603_R]
R5  1K  [0603_R]
R6  1K  [0603_R]
R7  18K  [0603_R]
R8  1K  [0603_R]
R9  3K  [0603_R]
R10  500R  [0603_R]
R11  0.02R  [2512_R]
R12  1K  [0603_R]
R13  10K  [0603_R]
R14  4.7K  [0603_R]
R15  1K  [0603_R]
R16  18K  [0603_R]
R17  10K  [0603_R]
R18  4.7K  [0603_R]
R19  6K  [0603_R]
R20  1K  [0603_R]
R21  2R  [0603_R]
R22  3K  [0603_Rx4]
R23  10K  [0603_R]
S1  SW  [微动开关-1]
S2  OFF  [微动开关-1]
S3  ON  [微动开关-1]
U3  AMS1117  [AMS1117]  (value not drawn)
U4  TPS5450  [SOP-8_EP_150mil]
U5  STM32F030F4P6  [STM-TSSOP20_L]
U6  LM358  [SOIC-8_208mil]
U7  IP6525T  [IP6525T]
USB1  USB-A  [USB-A]

### Nets
GND: C8.2 C9.2(K) C11.2 C12.1 C13.1 C14.2 C15.2(K) C16.1 C18.1 C19.1 C20.1 C21.2 C22.1 C23.1 C25.2 C26.1 C27.1 C28.1 C29.2 D1.A D4.1(A) J17.4 J？1.2 LED1.K LS1.2(-) Q3.3(E) R2.1 R8.2 R9.1 R11.1 R12.2 R15.1 R16.2 R17.2 R23.1 S2.1 U3.1(GND) U4.0(GND) U4.2(NC) U4.6(GND) U5.15(VSS) U7.1(GND) U7.9(EP) USB1.1(GND)
VAT+: C10.2 C12.2 J8.1 Q2.3(S) R3.2 R4.2
VAT-: C17.1 J8.2 R6.2 R11.2 U6.4
VC-: C15.1(A) C16.2 C26.2 D3.K U4.7(VIN) U7.7(VIN)
VCC: C17.2 C19.2 C20.2 D3.A Q2.2(D) R14.2 U6.8
VCC_3.3V: C14.1 C22.2 J17.1 Q4.3(E) S1.1 U3.2(Out) U5.5(VDDA) U5.16(VDD)
VCC_5V: C8.1 C9.1(A) C13.2 D2.1(A) L1.2 LED2.4(A) LED3.A LED5.A R1.2 R18.2
ABAT: D4.2(K) R13.1 U5.6(PA0)
BLUE: LED2.3(BULE_K) R22.3
BZZ: R20.2 U5.9(PA3)
GREEN: LED2.2(GREEN_K) R22.2
KEY0: Q1.2(D) R5.2 R9.2 R10.2 S2.2 S3.2
LED1: LED3.K R19.1
LED2: C29.1 LED5.K R22.4
PA4: R22.8 U5.10(PA4)
PA5: R22.7 U5.11(PA5)
PA6: R22.6 U5.12(PA6)
PA7: R22.5 U5.13(PA7)
PB1: C25.1 R19.2 U5.14(PB1)
PIN1: Q1.3(S) R3.1 S3.1
RED: LED2.1(RED_K) R22.1
RST: C18.2 R8.1 S1.2 U5.4(NRST)
RX: J18.2 U5.18(PA10)
SWCLK: J17.3 U5.20(PA14(SWCLK))
SWDIO: J17.2 U5.19(PA13(SWDIO))
TX: J18.1 U5.17(PA9)
USB_N: U7.5(DM) USB1.2(D-)
USB_P: U7.6(DP) USB1.3(D+)
VBAT: C21.1 R14.1 R15.2 U5.7(PA1)
VOUT: C27.2 L2.1 LED4.A U7.8(VOUT) USB1.4(VCC)
VTEM: C23.2 J？1.1 R18.1 U5.8(PA2)
NetC7_1: C7.1 U4.1(BT)
NetC7_2: C7.2 D1.K L1.1 U4.8(PH)
NetC10_1: C10.1 Q1.1(G) Q2.1(G) Q3.2(C) R4.1
NetC11_1: C11.1 D2.2(K) U3.3(In)
NetC24_1: C24.1 U7.3(BST)
NetC24_2: C24.2 L2.2 R21.2 U7.2(SW)
NetC28_2: C28.2 R21.1
NetLED1_A: LED1.A R10.1
NetLED4_K: LED4.K R23.2
NetLS1_1: LS1.1(+) Q4.2(C)
NetQ3_1: Q3.1(B) R5.1
NetQ4_1: Q4.1(B) R20.1
NetR1_1: R1.1 R2.2 U4.4(VSE)
NetR6_1: R6.1 R7.2 U6.2
NetR7_1: R7.1 R13.2 U6.1
NetR12_1: R12.1 R16.1 U6.3
NetR17_1: R17.1 U5.1(BOOT0)

Not connected (* = marked no-connect by the designer): U4 3(NC)* 5(ENA)*; U5 2(PF0-OSC_IN(PF0))* 3(PF1-OSC_OUT(PF1))*; U6 5* 6* 7*; U7 4(NC)*

### Layout directives
differential pair: USB_N, USB_P

### Notes on the sheet
- (in symbol C-CS) +

### Library data of the parts
C7 C10 C12 C13 C16-C29 = C0805
C8 C11 C14 = CAP-E: 电解电容
C9 C15 = C-CS: 直插固态电容; 版权归属: 源创客; BOM名称: 直插固态电容; 学习资源: www.ooocke.com
D2 D4 = Diode: 二极管; Published: 8-Jun-2000; LatestRevisionDate: 17-Jul-2002; LatestRevisionNote: Re-released for DXP Platform.; PackageDocument: Sep-1996; PackageReference: SMC; Publisher: Altium Limited; Code_JEDEC: DO-214-AB
J8 J？1 = FD-SIP2
J17 = Header 4: Header, 4-Pin; LatestRevisionDate: 17-Jul-2002; LatestRevisionNote: Re-released for DXP Platform.; Publisher: Altium Limited
J18 = Header 2: Header, 2-Pin; LatestRevisionDate: 17-Jul-2002; LatestRevisionNote: Re-released for DXP Platform.; Publisher: Altium Limited
L1 L2 = 贴片电感
LED2 = LED-RGB-3528: 三基色LED; 版权归属: 源创客; BOM名称: 三基色LED; 学习资源: www.ooocke.com
LED3 LED5 = LED0805
Q1 Q2 = P40NF10L: N沟场效应管; 版权归属: 源创客; BOM名称: N沟场效应管; 学习资源: www.ooocke.com
Q3 = 44H11: 互补功率-NPN型; 版权归属: 源创客; 属性: 80V 8A 50W; BOM名称: 互补功率-NPN型; 学习资源: www.ooocke.com
Q4 = TIP42C: 互补功率-PNP型; 版权归属: 源创客; 属性: 100V 6A 65W; BOM名称: 互补功率-PNP型; 学习资源: www.ooocke.com
R1-R21 R23 = Res1: Resistor
  R1-R16 R18-R21 R23: Published: 8-Jun-2000; LatestRevisionDate: 17-Jul-2002; LatestRevisionNote: Re-released for DXP Platform.; PackageReference: AXIAL-0.3; Publisher: Altium Limited; PackageDescription: Axial Device, Thru-Hole; 2 Leads; 0.3 in Pin Spacing
R22 = R-8P4R: 贴片网络排阻; 版权归属: 源创客; BOM名称: 贴片网络排阻; 学习资源: www.ooocke.com
S1-S3 = 微动开关
U4 = Component_6
U5 = STM32F030F4P6: ARM Cortex-M0 32-bit MCU, 16 KB Flash, 4 KB Internal RAM, 15 I/Os, 20-pin TSSOP, -40 to 85 degC, Tube; FLASH Size (Prog) (kB): 16; I/Os (High Current): 15; Internal RAM Size (kB): 4; Operating Frequency(F) (Processor speed) (MHz): 48; Supply Voltage(Vcc) min (V): 2.4; DatasheetVersion: Rev. 1; PackageVersion: Rev. 1, 11/2012; PackageReference: TSSOP20; PackageDescription: 20-Pin Thin Shrink Small Outline Package, 6.5 x 4.4 mm Body, 0.65 mm Pitch; Supplier 1: Digi-Key; Supplier Part Number 1: 497-14044-5-ND; Supplier 2: Newark; Supplier Part Number 2: 06X3648; Supplier 3: Mouser; Supplier Part Number 3: 511-STM32F030F4P6; Core: ARM Cortex-M0; Packing: Tube; Mounting Technology: Surface Mount; PartNumber: STM32F030F4P6; ComponentLink1Description: Manufacturer URL; ComponentLink1URL: http://www.st.com/web/en/home.html; ComponentLink2Description: Datasheet; ComponentLink2URL: http://www.st.com/st-web-ui/static/active/en/resource/technical/document/datasheet/DM00088500.pdf; ComponentLink3Description: Package Specification; ComponentLink3URL: http://www.st.com/st-web-ui/static/active/en/resource/technical/document/datasheet/DM00065136.pdf
U6 = Component_8
U7 = Component_7

## Sheet CH340G.SchDoc
size A4
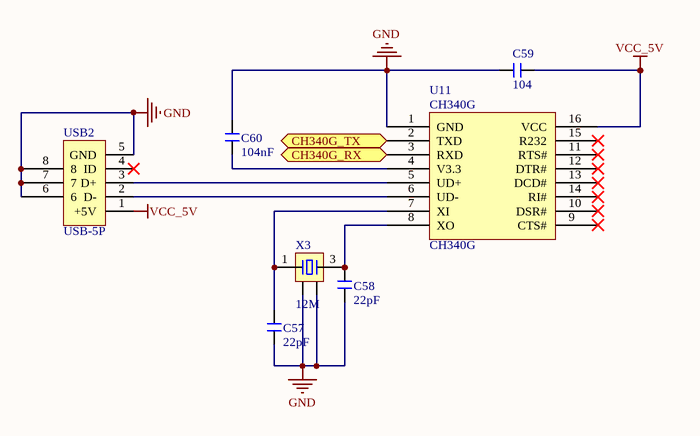
[diagram p7: CH340G.SchDoc]

### Parts
C57  22pF  [0603_C]
C58  22pF  [0603_C]
C59  104  [0603_C]
C60  104nF  [0603_C]
U11  CH340G  [SOIC-16_150mil]
USB2  USB-5P  [micro_usb_47589]
X3  12M  [SMD-3225_4P]

### Ports
CH340G_RX (bidir), CH340G_TX (bidir)

### Nets
GND: C57.2 C58.2 C59.1 C60.2 U11.1(GND) USB2.5(GND) USB2.6 USB2.7 USB2.8 X3.2 X3.4
VCC_5V: C59.2 U11.16(VCC) USB2.1(+5V)
NetC57_1: C57.1 U11.7(XI) X3.1
NetC58_1: C58.1 U11.8(XO) X3.3
NetC60_1: C60.1 U11.4(V3.3)
NetU8_90: U11.2(TXD) ; port CH340G_TX
NetU8_91: U11.3(RXD) ; port CH340G_RX
NetU11_5: U11.5(UD+) USB2.3(D+)
NetU11_6: U11.6(UD-) USB2.2(D-)

Not connected (* = marked no-connect by the designer): U11 9(CTS#)* 10(DSR#)* 11(RTS#)* 12(DTR#)* 13(DCD#)* 14(RI#)* 15(R232)*; USB2 4(ID)*

### Library data of the parts
C57-C60 = C: 无极性贴片电容
U11 = CH340G: USB; ComponentLink1Description: 供应商链接; ComponentLink1URL: http://www.szlcsc.com/product/details_14927.html; Package: SOIC-16_150mil; Supplier: LC; SuppliersPartNumber: C14267
USB2 = USB-5P: 微型USB母座; 版权归属: 源创客; BOM名称: 微型USB母座; 学习资源: www.ooocke.com
X3 = XTAL-4P: 4脚无源晶振

## Nets that join several sheets
GND: Flame (J1.1 J2.1 J3.1), STM32F4 (39 pins), Sm_Rt_LED_Bu (16 pins), Ultrasonic_HC-SR04 (J13.1 J14.1 J15.1 J16.1), Motor_Driver (20 pins), Power (44 pins), CH340G (11 pins)
VCC: Motor_Driver (10 pins), Power (7 pins)
VCC_3.3V: Sm_Rt_LED_Bu (7 pins), Power (8 pins)
VCC_5V: Flame (J1.2 J2.2 J3.2), Sm_Rt_LED_Bu (J9.3 J10.3 J11.3 J12.5), Ultrasonic_HC-SR04 (J13.4 J14.4 J15.4 J16.4), Motor_Driver (8 pins), Power (10 pins), CH340G (C59.2 U11.16 USB2.1)
NetJ1_3: Flame (J1.3), STM32F4 (U8.123)
NetJ1_4: Flame (J1.4), STM32F4 (U8.118)
NetJ1_5: Flame (J1.5), STM32F4 (U8.117)
NetJ1_6: Flame (J1.6), STM32F4 (U8.115)
NetJ1_7: Flame (J1.7), STM32F4 (U8.114)
NetJ2_3: Flame (J2.3), STM32F4 (U8.129)
NetJ2_4: Flame (J2.4), STM32F4 (U8.128)
NetJ2_5: Flame (J2.5), STM32F4 (U8.126)
NetJ2_6: Flame (J2.6), STM32F4 (U8.125)
NetJ2_7: Flame (J2.7), STM32F4 (U8.124)
NetJ3_3: Flame (J3.3), STM32F4 (U8.64)
NetJ3_4: Flame (J3.4), STM32F4 (U8.63)
NetJ3_5: Flame (J3.5), STM32F4 (U8.59)
NetJ3_6: Flame (J3.6), STM32F4 (U8.58)
NetJ3_7: Flame (J3.7), STM32F4 (U8.132)
NetJ4_3: STM32F4 (U8.133), Motor_Driver (J4.3)
NetJ4_4: STM32F4 (U8.110), Motor_Driver (J4.4)
NetJ5_3: STM32F4 (U8.135), Motor_Driver (J5.3)
NetJ5_4: STM32F4 (U8.42), Motor_Driver (J5.4)
NetJ6_3: STM32F4 (U8.97), Motor_Driver (J6.3)
NetJ6_4: STM32F4 (U8.96), Motor_Driver (J6.4)
NetJ7_3: STM32F4 (U8.137), Motor_Driver (J7.3)
NetJ7_4: STM32F4 (U8.136), Motor_Driver (J7.4)
NetJ9_2: STM32F4 (U8.68), Sm_Rt_LED_Bu (J9.2)
NetJ10_2: STM32F4 (U8.67), Sm_Rt_LED_Bu (J10.2)
NetJ11_1: STM32F4 (U8.73), Sm_Rt_LED_Bu (J11.1)
NetJ12_3: STM32F4 (U8.60), Sm_Rt_LED_Bu (J12.3)
NetJ12_4: STM32F4 (U8.74), Sm_Rt_LED_Bu (J12.4)
NetJ13_2: STM32F4 (U8.44), Ultrasonic_HC-SR04 (J13.2)
NetJ13_3: STM32F4 (U8.45), Ultrasonic_HC-SR04 (J13.3)
NetJ14_2: STM32F4 (U8.46), Ultrasonic_HC-SR04 (J14.2)
NetJ14_3: STM32F4 (U8.47), Ultrasonic_HC-SR04 (J14.3)
NetJ15_2: STM32F4 (U8.18), Ultrasonic_HC-SR04 (J15.2)
NetJ15_3: STM32F4 (U8.49), Ultrasonic_HC-SR04 (J15.3)
NetJ16_2: STM32F4 (U8.65), Ultrasonic_HC-SR04 (J16.2)
NetJ16_3: STM32F4 (U8.66), Ultrasonic_HC-SR04 (J16.3)
NetR24_1: STM32F4 (U8.70), Sm_Rt_LED_Bu (R24.1)
NetR25_1: STM32F4 (U8.35), Sm_Rt_LED_Bu (R25.1)
NetR31_1: STM32F4 (U8.76), Sm_Rt_LED_Bu (R31.1 U9.24)
NetR32_1: STM32F4 (U8.75), Sm_Rt_LED_Bu (R32.1 U9.23)
NetU1_15: STM32F4 (U8.5), Motor_Driver (U1.15)
NetU1_16: STM32F4 (U8.101), Motor_Driver (U1.16)
NetU1_17: STM32F4 (U8.100), Motor_Driver (U1.17)
NetU1_19: STM32F4 (U8.104), Motor_Driver (U1.19)
NetU1_21: STM32F4 (U8.99), Motor_Driver (U1.21)
NetU1_22: STM32F4 (U8.98), Motor_Driver (U1.22)
NetU1_23: STM32F4 (U8.4), Motor_Driver (U1.23)
NetU2_15: STM32F4 (U8.37), Motor_Driver (U2.15)
NetU2_16: STM32F4 (U8.93), Motor_Driver (U2.16)
NetU2_17: STM32F4 (U8.92), Motor_Driver (U2.17)
NetU2_19: STM32F4 (U8.103), Motor_Driver (U2.19)
NetU2_21: STM32F4 (U8.86), Motor_Driver (U2.21)
NetU2_22: STM32F4 (U8.85), Motor_Driver (U2.22)
NetU2_23: STM32F4 (U8.36), Motor_Driver (U2.23)
NetU8_19: STM32F4 (U8.19), Sm_Rt_LED_Bu (U10.2)
NetU8_20: STM32F4 (U8.20), Sm_Rt_LED_Bu (U10.7)
NetU8_21: STM32F4 (U8.21), Sm_Rt_LED_Bu (U9.12)
NetU8_28: STM32F4 (U8.28), Sm_Rt_LED_Bu (U10.6)
NetU8_40: STM32F4 (U8.40), Sm_Rt_LED_Bu (U10.3)
NetU8_41: STM32F4 (U8.41), Sm_Rt_LED_Bu (U10.4)
NetU8_43: STM32F4 (U8.43), Sm_Rt_LED_Bu (U10.5)
NetU8_90: STM32F4 (U8.90), CH340G (U11.2)
NetU8_91: STM32F4 (U8.91), CH340G (U11.3)